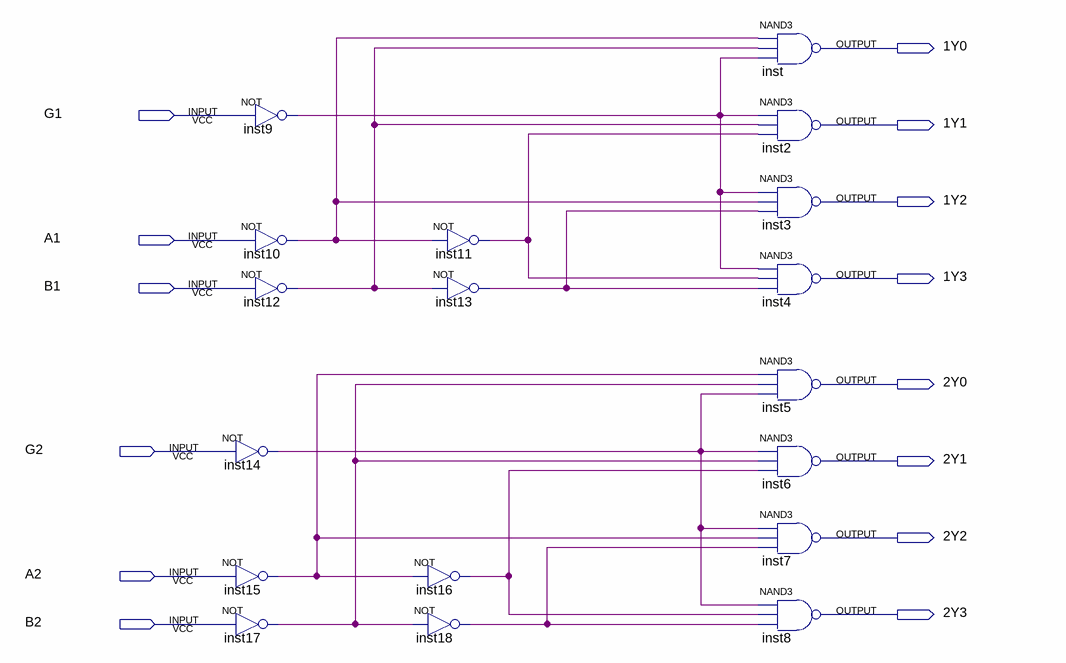
[diagram p0: schematic sheet]
// Quartus schematic ci_74LS139.bdf as structural Verilog: 18 symbols, 14 pins
module ci_74LS139 (
  input  G1,
  input  A1,
  input  B1,
  input  G2,
  input  A2,
  input  B2,
  output \1Y0 ,
  output \1Y1 ,
  output \1Y2 ,
  output \1Y3 ,
  output \2Y0 ,
  output \2Y1 ,
  output \2Y2 ,
  output \2Y3 
);

  wire inst9_out, inst10_out, inst11_out, inst12_out, inst13_out, inst14_out, inst15_out, inst16_out,
       inst17_out, inst18_out;

  not inst14 (inst14_out, G2);
  not inst15 (inst15_out, A2);
  not inst17 (inst17_out, B2);
  not inst9 (inst9_out, G1);
  not inst10 (inst10_out, A1);
  not inst12 (inst12_out, B1);
  not inst11 (inst11_out, inst10_out);
  not inst13 (inst13_out, inst12_out);
  not inst16 (inst16_out, inst15_out);
  not inst18 (inst18_out, inst17_out);
  nand inst (\1Y0 , inst10_out, inst12_out, inst9_out);
  nand inst2 (\1Y1 , inst9_out, inst12_out, inst11_out);
  nand inst3 (\1Y2 , inst9_out, inst10_out, inst13_out);
  nand inst4 (\1Y3 , inst9_out, inst11_out, inst13_out);
  nand inst5 (\2Y0 , inst15_out, inst17_out, inst14_out);
  nand inst6 (\2Y1 , inst14_out, inst17_out, inst16_out);
  nand inst7 (\2Y2 , inst14_out, inst15_out, inst18_out);
  nand inst8 (\2Y3 , inst14_out, inst16_out, inst18_out);
endmodule
